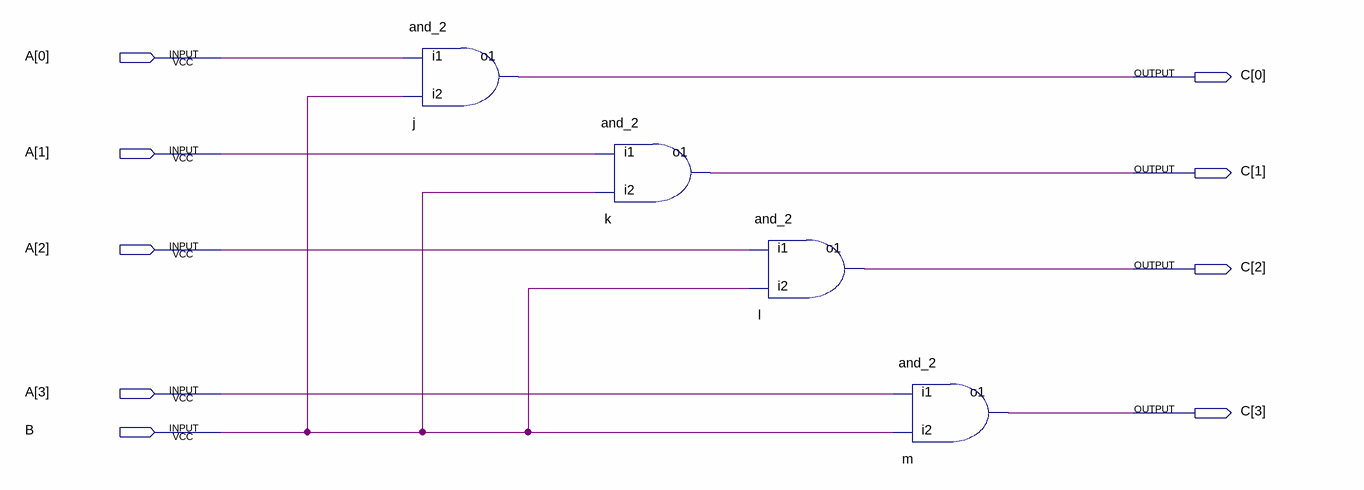
[diagram p0: schematic sheet]
// Quartus schematic 4to1MU.bdf as structural Verilog: 4 symbols, 9 pins
module \4to1MU  (
  input  [3:0] A,
  input  B,
  output [3:0] C
);

  and_2 j (.i1(A[0]), .i2(B), .o1(C[0]));
  and_2 k (.i1(A[1]), .i2(B), .o1(C[1]));
  and_2 l (.i1(A[2]), .i2(B), .o1(C[2]));
  and_2 m (.i1(A[3]), .i2(B), .o1(C[3]));
endmodule
